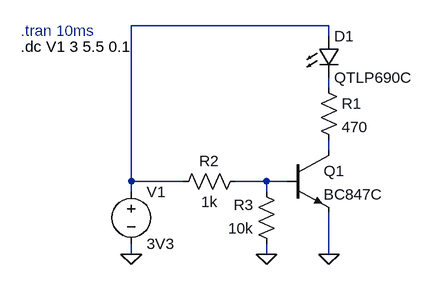
[diagram p0: schematic ComutareaLEDurilor.asc]
ComutareaLEDurilor.asc, the LTspice schematic file:
Version 4
SHEET 1 880 680
WIRE 448 -128 144 -128
WIRE 448 -112 448 -128
WIRE 448 -32 448 -48
WIRE 448 64 448 48
WIRE 144 112 144 -128
WIRE 224 112 144 112
WIRE 352 112 304 112
WIRE 384 112 352 112
WIRE 144 128 144 112
WIRE 352 128 352 112
WIRE 144 224 144 208
WIRE 352 224 352 208
WIRE 448 224 448 160
FLAG 144 224 0
FLAG 448 224 0
FLAG 352 224 0
SYMBOL voltage 144 112 R0
SYMATTR InstName V1
SYMATTR Value 3V3
SYMBOL res 432 -48 R0
SYMATTR InstName R1
SYMATTR Value 470
SYMBOL LED 432 -112 R0
SYMATTR InstName D1
SYMATTR Value QTLP690C
SYMATTR Description Diode
SYMATTR Type diode
SYMBOL npn 384 64 R0
SYMATTR InstName Q1
SYMATTR Value BC847C
SYMBOL res 320 96 R90
WINDOW 0 0 56 VBottom 2
WINDOW 3 32 56 VTop 2
SYMATTR InstName R2
SYMATTR Value 1k
SYMBOL res 368 224 R180
WINDOW 0 36 76 Left 2
WINDOW 3 36 40 Left 2
SYMATTR InstName R3
SYMATTR Value 10k
TEXT -26 -120 Left 2 ;.tran 10ms
TEXT -26 -96 Left 2 !.dc V1 3 5.5 0.1

The netlist it stands for:
* ComutareaLEDurilor.asc
V1 N001 0 3V3
R1 N002 N003 470
D1 N001 N002 QTLP690C
Q1 N003 N004 0 0 BC847C
R2 N004 N001 1k
R3 0 N004 10k
.model D D
.lib standard.dio
.model NPN NPN
.model PNP PNP
.lib standard.bjt
* .tran 10ms
.dc V1 3 5.5 0.1
.backanno
.end